# EAGLE design ESP32ProtypeBoard (EAGLE 9.6.2)
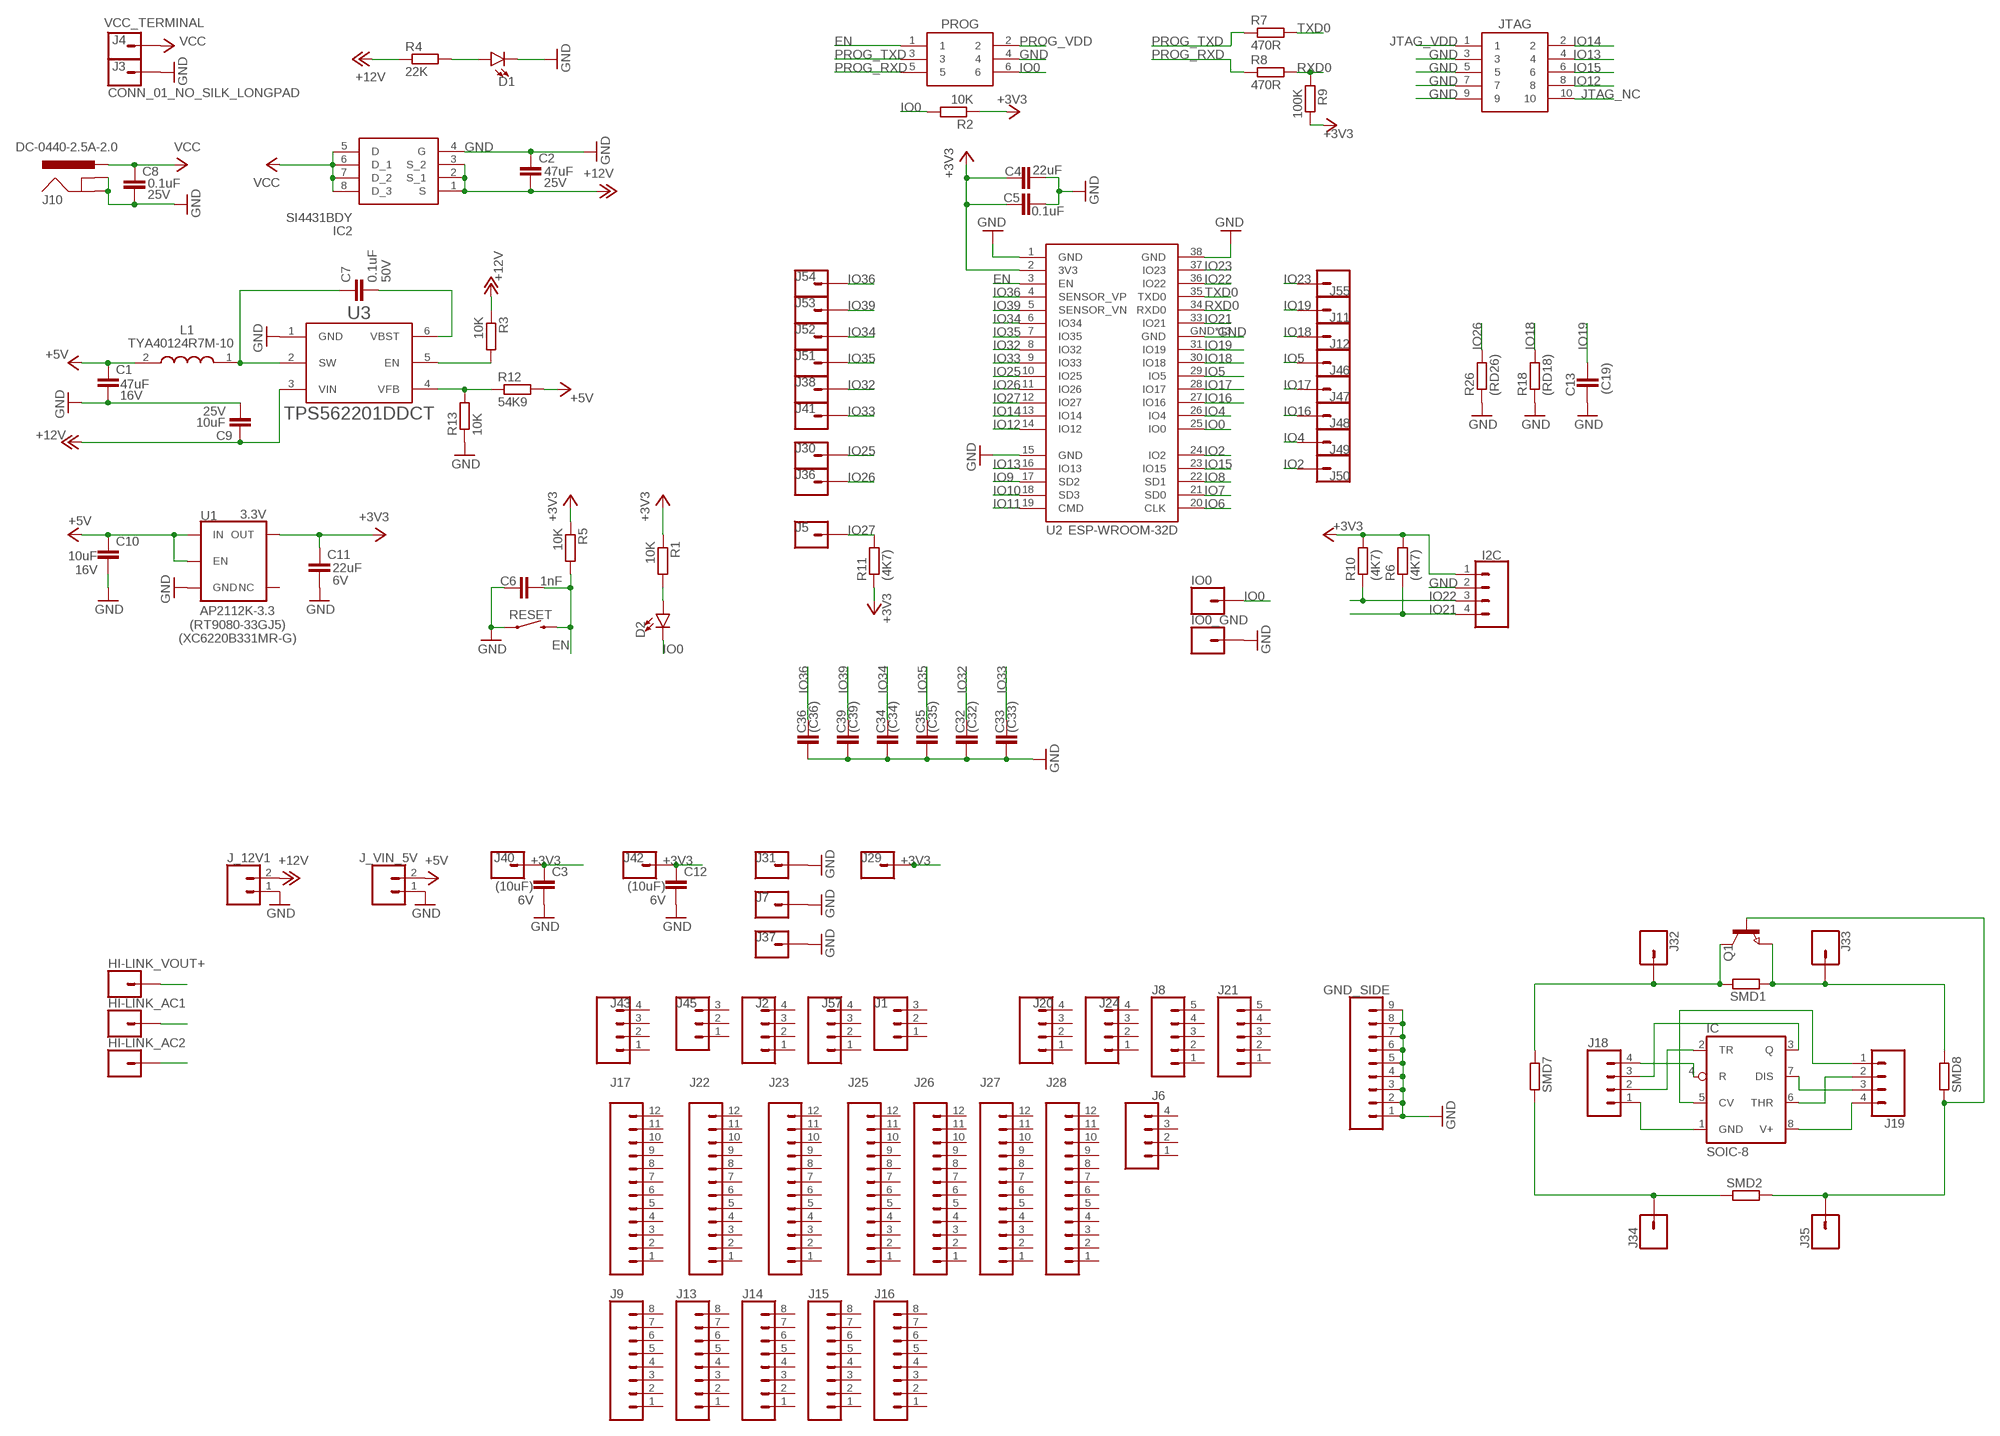
[diagram p0: schematic, sheet 1]

## Parts
C1  47uF  C-EUC1206K  [C1206K]
C2  47uF  C-EUC1206K  [C1206K]
C3  (10uF)  C-EUC0805K  [C0805K]
C4  22uF  C-EUC0805K  [C0805K]
C5  0.1uF  C-EUC0805K  [C0805K]
C6  1nF  C-EUC0805K  [C0805K]
C7  0.1uF  C-EUC0805K  [C0805K]
C8  0.1uF  C-EUC0805K  [C0805K]
C9  10uF  C-EUC0805K  [C0805K]
C10  10uF  C-EUC0805K  [C0805K]
C11  22uF  C-EUC0805K  [C0805K]
C12  (10uF)  C-EUC0805K  [C0805K]
C13  (C19)  C-EUC0805K  [C0805K]
C32  (C32)  C-EUC0805K  [C0805K]
C33  (C33)  C-EUC0805K  [C0805K]
C34  (C34)  C-EUC0805K  [C0805K]
C35  (C35)  C-EUC0805K  [C0805K]
C36  (C36)  C-EUC0805K  [C0805K]
C39  (C39)  C-EUC0805K  [C0805K]
D1  PWR  LEDCHIPLED_0805  [CHIPLED_0805]
D2  GREEN  LEDCHIPLED_0805  [CHIPLED_0805]
GND_SIDE  CONN_09NO_SILK  [1X09_NO_SILK]
HI-LINK_AC1  CONN_01PTH_NO_SILK_KIT  [1X01NS_KIT]
HI-LINK_AC2  CONN_01PTH_NO_SILK_KIT  [1X01NS_KIT]
HI-LINK_VOUT+  CONN_01PTH_NO_SILK_KIT  [1X01NS_KIT]
I2C  CONN_041X04_NO_SILK  [1X04_NO_SILK]
IC  SOIC-8  LM555D  [SO08]
IC2  SI4431BDY  SI4431BDY-T1-E3  [SOIC127P600X175-8N]
IO0  CONN_01PTH_NO_SILK_KIT  [1X01NS_KIT]
IO0_GND  CONN_01PTH_NO_SILK_YES_STOP  [1X01_NO_SILK]
J1  CONN_03_NO_SILK  [1X03_NO_SILK]
J2  CONN_04_NO_SILK  [1X04_NO_SILK]
J3  CONN_01_NO_SILK_LONGPAD  [1X01_NO_SILK_LONGPAD]
J4  VCC_TERMINAL  CONN_01_NO_SILK_LONGPAD  [1X01_NO_SILK_LONGPAD]
J5  CONN_01_NO_SILK  [1X01_NO_SILK]
J6  CONN_04_NO_SILK  [1X04_NO_SILK]
J7  CONN_01_NO_SILK  [1X01_NO_SILK]
J8  CONN_05_NO_SILK  [1X05_NO_SILK]
J9  CONN_08NO_SILK_FEMALE_PTH  [1X08_NO_SILK]
J10  DC-0440-2.5A-2.0  [DC044025A20]
J11  CONN_01PTH_NO_SILK_YES_STOP  [1X01_NO_SILK]
J12  CONN_01PTH_NO_SILK_YES_STOP  [1X01_NO_SILK]
J13  CONN_08NO_SILK_FEMALE_PTH  [1X08_NO_SILK]
J14  CONN_08NO_SILK_FEMALE_PTH  [1X08_NO_SILK]
J15  CONN_08NO_SILK_FEMALE_PTH  [1X08_NO_SILK]
J16  CONN_08NO_SILK_FEMALE_PTH  [1X08_NO_SILK]
J17  CONN_12NO_SILK  [1X12_NO_SILK]
J18  CONN_041X04_NO_SILK  [1X04_NO_SILK]
J19  CONN_041X04_NO_SILK  [1X04_NO_SILK]
J20  CONN_04_NO_SILK  [1X04_NO_SILK]
J21  CONN_05_NO_SILK  [1X05_NO_SILK]
J22  CONN_12NO_SILK  [1X12_NO_SILK]
J23  CONN_12NO_SILK  [1X12_NO_SILK]
J24  CONN_04_NO_SILK  [1X04_NO_SILK]
J25  CONN_12NO_SILK  [1X12_NO_SILK]
J26  CONN_12NO_SILK  [1X12_NO_SILK]
J27  CONN_12NO_SILK  [1X12_NO_SILK]
J28  CONN_12NO_SILK  [1X12_NO_SILK]
J29  CONN_01_NO_SILK  [1X01_NO_SILK]
J30  CONN_01_NO_SILK  [1X01_NO_SILK]
J31  CONN_01_NO_SILK  [1X01_NO_SILK]
J32  CONN_01PTH_NO_SILK_YES_STOP  [1X01_NO_SILK]
J33  CONN_01PTH_NO_SILK_YES_STOP  [1X01_NO_SILK]
J34  CONN_01PTH_NO_SILK_YES_STOP  [1X01_NO_SILK]
J35  CONN_01PTH_NO_SILK_YES_STOP  [1X01_NO_SILK]
J36  CONN_01_NO_SILK  [1X01_NO_SILK]
J37  CONN_01_NO_SILK  [1X01_NO_SILK]
J38  CONN_01_NO_SILK  [1X01_NO_SILK]
J40  CONN_01_NO_SILK  [1X01_NO_SILK]
J41  CONN_01_NO_SILK  [1X01_NO_SILK]
J42  CONN_01_NO_SILK  [1X01_NO_SILK]
J43  CONN_04_NO_SILK  [1X04_NO_SILK]
J45  CONN_03_NO_SILK  [1X03_NO_SILK]
J46  CONN_01PTH_NO_SILK_YES_STOP  [1X01_NO_SILK]
J47  CONN_01PTH_NO_SILK_YES_STOP  [1X01_NO_SILK]
J48  CONN_01PTH_NO_SILK_YES_STOP  [1X01_NO_SILK]
J49  CONN_01PTH_NO_SILK_YES_STOP  [1X01_NO_SILK]
J50  CONN_01PTH_NO_SILK_YES_STOP  [1X01_NO_SILK]
J51  CONN_01_NO_SILK  [1X01_NO_SILK]
J52  CONN_01_NO_SILK  [1X01_NO_SILK]
J53  CONN_01_NO_SILK  [1X01_NO_SILK]
J54  CONN_01_NO_SILK  [1X01_NO_SILK]
J55  CONN_01PTH_NO_SILK_YES_STOP  [1X01_NO_SILK]
J57  CONN_04_NO_SILK  [1X04_NO_SILK]
J_12V1  CONN_021X02_NO_SILK  [1X02_NO_SILK]
J_VIN_5V  CONN_021X02_NO_SILK  [1X02_NO_SILK]
JTAG  DC3-10-1P27  [DC3-10-1P27]
L1  TYA40124R7M-10  [INDPM4040X130N]
PROG  DC3-06-1P27  [DC3-06-1P27]
Q1  NPN-TRANSISTOR_SOT23  [SOT23]
R1  10K  R-EU_R0805  [R0805]
R2  10K  R-EU_R0805  [R0805]
R3  10K  R-EU_R0805  [R0805]
R4  22K  R-EU_R0805  [R0805]
R5  10K  R-EU_R0805  [R0805]
R6  (4K7)  R-EU_R0805  [R0805]
R7  470R  R-EU_R0805  [R0805]
R8  470R  R-EU_R0805  [R0805]
R9  100K  R-EU_R0805  [R0805]
R10  (4K7)  R-EU_R0805  [R0805]
R11  (4K7)  R-EU_R0805  [R0805]
R12  54K9  R-EU_R0805  [R0805]
R13  10K  R-EU_R0805  [R0805]
R18  (RD18)  R-EU_R0805  [R0805]
R26  (RD26)  R-EU_R0805  [R0805]
RESET  RESET  TACTILE_SWITCH_SMD_4X3MM  [TACTILE_SWITCH_SMD_4X3MM]
SMD1  RR1206  [R1206]
SMD2  RR1206  [R1206]
SMD7  RR1206  [R1206]
SMD8  RR1206  [R1206]
U1  3.3V  V_REG_AP2112K-3.3V  [SOT23-5]
U2  ESP-WROOM-32D  [ESP-WROOM-32D]
U3  TPS562201DDCTTEXAS_INSTRUMENTS_TPS562201DDCT_0_0  [TEXAS_INSTRUMENTS_TPS562201DDCT_0]

## Nets
+3V3: C3.1 C4.1 C5.1 C11.1 C12.1 I2C.1 J29.1 J40.1 J42.1 R1.1 R2.1 R5.1 R6.2 R9.1 R10.2 R11.1 U1.5(OUT) U2.2(3V3)
+5V: C1.1 C10.1 J_VIN_5V.2 L1.2 R12.2 U1.1(IN) U1.3(EN)
+12V: C2.2 C9.1 IC2.1(S) IC2.2(S_1) IC2.3(S_2) J_12V1.2 R3.1 R4.1 U3.3(VIN)
AC1: HI-LINK_AC1.1
AC2: HI-LINK_AC2.1
D2A: D2.A R1.2
EN: C6.2 PROG.1 R5.2 RESET.2 U2.3(EN)
GND: C1.2 C2.1 C3.2 C4.2 C5.2 C6.1 C8.2 C9.2 C10.2 C11.2 C12.2 C13.2 C32.1 C33.1 C34.1 C35.1 C36.1 C39.1 D1.C GND_SIDE.1 GND_SIDE.2 GND_SIDE.3 GND_SIDE.4 GND_SIDE.5 GND_SIDE.6 GND_SIDE.7 GND_SIDE.8 GND_SIDE.9 I2C.2 IC2.4(G) IO0_GND.1 J3.1 J7.1 J10.2(GND) J10.3(GNDBREAK) J31.1 J37.1 J_12V1.1 J_VIN_5V.1 JTAG.3 JTAG.5 JTAG.7 JTAG.9 PROG.4 R13.1 R18.1 R26.1 RESET.1 U1.2(GND) U2.1(GND) U2.15(GND) U2.38(GND) U2.GND U2.GND_1(GND) U2.GND_2(GND) U2.GND_3(GND) U2.GND_4(GND) U2.GND_5(GND) U2.GND_6(GND) U2.GND_7(GND) U2.GND_8(GND) U2.GND_9(GND) U2.GND_10(GND) U2.GND_11(GND) U2.GND_12(GND) U3.1(GND)
IO0: D2.C IO0.1 PROG.6 R2.2 U2.25(IO0)
IO2: J50.1 U2.24(IO2)
IO4: J49.1 U2.26(IO4)
IO5: J46.1 U2.29(IO5)
IO6 [NC]: U2.20(CLK)
IO7 [NC]: U2.21(SD0)
IO8 [NC]: U2.22(SD1)
IO9 [NC]: U2.17(SD2)
IO10 [NC]: U2.18(SD3)
IO11 [NC]: U2.19(CMD)
IO12: JTAG.8 U2.14(IO12)
IO13: JTAG.4 U2.16(IO13)
IO14: JTAG.2 U2.13(IO14)
IO15: JTAG.6 U2.23(IO15)
IO16: J48.1 U2.27(IO16)
IO17: J47.1 U2.28(IO17)
IO18: J12.1 R18.2 U2.30(IO18)
IO19: C13.1 J11.1 U2.31(IO19)
IO21: I2C.4 R6.1 U2.33(IO21)
IO22: I2C.3 R10.1 U2.36(IO22)
IO23: J55.1 U2.37(IO23)
IO25: J30.1 U2.10(IO25)
IO26: J36.1 R26.2 U2.11(IO26)
IO27: J5.1 R11.2 U2.12(IO27)
IO32: C32.2 J38.1 U2.8(IO32)
IO33: C33.2 J41.1 U2.9(IO33)
IO34: C34.2 J52.1 U2.6(IO34)
IO35: C35.2 J51.1 U2.7(IO35)
IO36: C36.2 J54.1 U2.4(SENSOR_VP)
IO39: C39.2 J53.1 U2.5(SENSOR_VN)
JTAG_NC: JTAG.10
JTAG_VDD: JTAG.1
N$3: IC.7(DIS) J19.3
N$4: IC.6(THR) J19.2
N$5: IC.1(GND) J18.1
N$6: IC.2(TR) J18.2
N$7: IC.3(Q) J18.3
N$8: IC.4(R) J18.4
N$9: IC.5(CV) J19.1
N$10: IC.8(V+) J19.4
N$13: HI-LINK_VOUT+.1
N$15: J34.1 SMD2.1 SMD7.2
N$16: J35.1 Q1.1(B) SMD2.2 SMD8.2
N$18: J32.1 Q1.3(C) SMD1.2 SMD7.1
N$19: J33.1 Q1.2(E) SMD1.1 SMD8.1
PROG_RXD: PROG.5 R8.1
PROG_TXD: PROG.3 R7.1
PROG_VDD: PROG.2
PWR_LED: D1.A R4.2
RXD0: R8.2 R9.2 U2.34(RXD0)
SW: C7.1 L1.1 U3.2(SW)
TXD0: R7.2 U2.35(TXD0)
VBST: C7.2 U3.6(VBST)
VCC: C8.1 IC2.5(D) IC2.6(D_1) IC2.7(D_2) IC2.8(D_3) J4.1 J10.1(PWR)
VEN: R3.2 U3.5(EN)
VFB: R12.1 R13.2 U3.4(VFB)
Unconnected: J1.1 J1.2 J1.3 J2.1 J2.2 J2.3 J2.4 J6.1 J6.2 J6.3 J6.4 J8.1 J8.2 J8.3 J8.4 J8.5 J9.1 J9.2 J9.3 J9.4 J9.5 J9.6 J9.7 J9.8 J13.1 J13.2 J13.3 J13.4 J13.5 J13.6 J13.7 J13.8 J14.1 J14.2 J14.3 J14.4 J14.5 J14.6 J14.7 J14.8 J15.1 J15.2 J15.3 J15.4 J15.5 J15.6 J15.7 J15.8 J16.1 J16.2 J16.3 J16.4 J16.5 J16.6 J16.7 J16.8 J17.1 J17.2 J17.3 J17.4 J17.5 J17.6 J17.7 J17.8 J17.9 J17.10 J17.11 J17.12 J20.1 J20.2 J20.3 J20.4 J21.1 J21.2 J21.3 J21.4 J21.5 J22.1 J22.2 J22.3 J22.4 J22.5 J22.6 J22.7 J22.8 J22.9 J22.10 J22.11 J22.12 J23.1 J23.2 J23.3 J23.4 J23.5 J23.6 J23.7 J23.8 J23.9 J23.10 J23.11 J23.12 J24.1 J24.2 J24.3 J24.4 J25.1 J25.2 J25.3 J25.4 J25.5 J25.6 J25.7 J25.8 J25.9 J25.10 J25.11 J25.12 J26.1 J26.2 J26.3 J26.4 J26.5 J26.6 J26.7 J26.8 J26.9 J26.10 J26.11 J26.12 J27.1 J27.2 J27.3 J27.4 J27.5 J27.6 J27.7 J27.8 J27.9 J27.10 J27.11 J27.12 J28.1 J28.2 J28.3 J28.4 J28.5 J28.6 J28.7 J28.8 J28.9 J28.10 J28.11 J28.12 J43.1 J43.2 J43.3 J43.4 J45.1 J45.2 J45.3 J57.1 J57.2 J57.3 J57.4 U1.4(NC)

## Notes on the sheet
- AP2112K-3.3
  (RT9080-33GJ5)
  (XC6220B331MR-G)

## Library data of the parts
C1 C10 = rcl:C-EU: CAPACITOR, European symbol; SPICEPREFIX: C; VOLTAGE: 16V
C2 C8 C9 = rcl:C-EU: CAPACITOR, European symbol; SPICEPREFIX: C; VOLTAGE: 25V
C3 C11 C12 = rcl:C-EU: CAPACITOR, European symbol; SPICEPREFIX: C; VOLTAGE: 6V
C4-C6 C13 C32-C36 C39 = rcl:C-EU: CAPACITOR, European symbol; SPICEPREFIX: C
C7 = rcl:C-EU: CAPACITOR, European symbol; SPICEPREFIX: C; VOLTAGE: 50V
D1 D2 = led:LED: LED OSRAM: - CHIPLED LG R971, LG N971, LY N971, LG Q971, LY Q971, LO R971, LY R971 LH N974, LH R974 LS Q976, LO Q976, LY Q976 LO Q996 - Hyper CHIPLED LW Q18S LB Q993, LB Q99A, LB R99A - SideLED LS A670, LO A670, LY A670, LG A670, LP A670 LB A673, LV A673, LT A673, LW A673 LH A674 LY A675 LS A676, LA A676, LO A676, LY A676, LW A676 LS A679, LY A679, LG A679 - Hyper Micro SIDELED® LS Y876, LA Y876, LO Y876, LY Y876 LT Y87S - SmartLED LW L88C, LW L88S LB L89C, LB L89S, LG L890 LS L89K, LO L89K, LY L89K LS L896, LA L896, LO L896, LY L896 - TOPLED LS T670, LO T670, LY T670, LG T670, LP T670 LSG T670, LSP T670, LSY T670, LOP T670, LYG T670 LG T671, LOG T671, LSG T671 LB T673, LV T673, LT T673, LW T673 LH T674 LS T676, LA T676, LO T676, LY T676, LB T676, LH T676, LSB T676, LW T676 LB T67C, LV T67C, LT T67C, LS T67K, LO T67K, LY T67K, LW E67C LS E67B, LA E67B, LO E67B, LY E67B, LB E67C, LV E67C, LT E67C LW T67C LS T679, LY T679, LG T679 LS T770, LO T770, LY T770, LG T770, LP T770 LB T773, LV T773, LT T773, LW T773 LH T774 LS E675, LA E675, LY E675, LS T675 LS T776, LA T776, LO T776, LY T776, LB T776 LHGB T686 LT T68C, LB T68C - Hyper Mini TOPLED® LB M676 - Mini TOPLED Santana® LG M470 LS M47K, LO M47K, LY M47K Source: http://www.osram.convergy.de LUXEON: - LUMILED® LXK2-PW12-R00, LXK2-PW12-S00, LXK2-PW14-U00, LXK2-PW14-V00 LXK2-PM12-R00, LXK2-PM12-S00, LXK2-PM14-U00 LXK2-PE12-Q00, LXK2-PE12-R00, LXK2-PE12-S00, LXK2-PE14-T00, LXK2-PE14-U00 LXK2-PB12-K00, LXK2-PB12-L00, LXK2-PB12-M00, LXK2-PB14-N00, LXK2-PB14-P00, LXK2-PB14-Q00 LXK2-PR12-L00, LXK2-PR12-M00, LXK2-PR14-Q00, LXK2-PR14-R00 LXK2-PD12-Q00, LXK2-PD12-R00, LXK2-PD12-S00 LXK2-PH12-R00, LXK2-PH12-S00 LXK2-PL12-P00, LXK2-PL12-Q00, LXK2-PL12-R00 Source: www.luxeon.com KINGBRIGHT: KA-3528ASYC Source: www.kingbright.com
GND_SIDE = SparkFun-Connectors:CONN_09: Multi connection point. Often used as Generic Header-pin footprint for 0.1 inch spaced/style header connections On any of the 0.1 inch spaced packages, you can populate with these: Break Away Headers - Straight <https://www.sparkfun.com/products/116> (PRT-00116) Break Away Male Headers - Right Angle <https://www.sparkfun.com/products/553> (PRT-00553) Female Headers <https://www.sparkfun.com/products/115> (PRT-00115) Break Away Headers - Machine Pin <https://www.sparkfun.com/products/117> (PRT-00117) Break Away Female Headers - Swiss Machine Pin <https://www.sparkfun.com/products/743> (PRT-00743) For SCREWTERMINALS and SPRING TERMINALS visit here: Screw Terimnals on SparkFun.com <https://www.sparkfun.com/search/results?term=Screw+Terminals> (5mm/3.5mm/2.54mm spacing) This device is also useful as a general connection point to wire up your design to another part of your project. Our various solder wires solder well into these plated through hole pads. Hook-Up Wire - Assortment (Stranded, 22 AWG) <https://www.sparkfun.com/products/11375> (PRT-11375) Hook-Up Wire - Assortment (Solid Core, 22 AWG) <https://www.sparkfun.com/products/11367> (PRT-11367) View the entire wire category on our website here <https://www.sparkfun.com/categories/141> Special notes: Molex polarized connector foot print use with SKU : PRT-08231 with associated crimp pins and housings. 1MM SMD Version SKU: PRT-10208 NOTES ON THE VARIANTS LOCK and LOCK_LONGPADS... This footprint was designed to help hold the alignment of a through-hole component (i.e. 6-pin header) while soldering it into place. You may notice that each hole has been shifted either up or down by 0.005 of an inch from it's more standard position (which is a perfectly straight line). This slight alteration caused the pins (the squares in the middle) to touch the edges of the holes. Because they are alternating, it causes a "brace" to hold the component in place. 0.005 has proven to be the perfect amount of "off-center" position when using our standard breakaway headers. Although looks a little odd when you look at the bare footprint, once you have a header in there, the alteration is very hard to notice. Also,if you push a header all the way into place, it is covered up entirely on the bottom side.
HI-LINK_AC1 HI-LINK_AC2 HI-LINK_VOUT+ IO0 IO0_GND J11 J12 J32-J35 J46-J50 J55 = SparkFun-Connectors:CONN_01: Single connection point. Often used as Generic Header-pin footprint for 0.1 inch spaced/style header connections On any of the 0.1 inch spaced packages, you can populate with these: Break Away Headers - Straight <https://www.sparkfun.com/products/116> (PRT-00116) Break Away Male Headers - Right Angle <https://www.sparkfun.com/products/553> (PRT-00553) Female Headers <https://www.sparkfun.com/products/115> (PRT-00115) Break Away Headers - Machine Pin <https://www.sparkfun.com/products/117> (PRT-00117) Break Away Female Headers - Swiss Machine Pin <https://www.sparkfun.com/products/743> (PRT-00743) This device is also useful as a general connection point to wire up your design to another part of your project. Our various solder wires solder well into these plated through hole pads. Hook-Up Wire - Assortment (Stranded, 22 AWG) <https://www.sparkfun.com/products/11375> (PRT-11375) Hook-Up Wire - Assortment (Solid Core, 22 AWG) <https://www.sparkfun.com/products/11367> (PRT-11367) View the entire wire category on our website here <https://www.sparkfun.com/categories/141> Special notes: SMTSO-256-ET is a "flush mount" nut for a 4-40 screw. We mostly use this on specialty testbeds; it is a nice way to connect hardware to your PCB at an adjustable hieght. Also note, the SNAP packages are for using a snappable style connector. We sell a baggie of snaps and they are also used on two LilyPad designs: Snap Assortment - 30 pack (male and female) <https://www.sparkfun.com/products/11347> (DEV-11347) LilyPad Arduino SimpleSnap <https://www.sparkfun.com/products/10941> (DEV-10941) LilyPad SimpleSnap Protoboard <https://www.sparkfun.com/products/10940> (DEV-10940)
I2C J18 J19 = SparkFun-Connectors:CONN_04: Multi connection point. Often used as Generic Header-pin footprint for 0.1 inch spaced/style header connections On any of the 0.1 inch spaced packages, you can populate with these: Break Away Headers - Straight <https://www.sparkfun.com/products/116> (PRT-00116) Break Away Male Headers - Right Angle <https://www.sparkfun.com/products/553> (PRT-00553) Female Headers <https://www.sparkfun.com/products/115> (PRT-00115) Break Away Headers - Machine Pin <https://www.sparkfun.com/products/117> (PRT-00117) Break Away Female Headers - Swiss Machine Pin <https://www.sparkfun.com/products/743> (PRT-00743) For SCREWTERMINALS and SPRING TERMINALS visit here: Screw Terimnals on SparkFun.com <https://www.sparkfun.com/search/results?term=Screw+Terminals> (5mm/3.5mm/2.54mm spacing) This device is also useful as a general connection point to wire up your design to another part of your project. Our various solder wires solder well into these plated through hole pads. Hook-Up Wire - Assortment (Stranded, 22 AWG) <https://www.sparkfun.com/products/11375> (PRT-11375) Hook-Up Wire - Assortment (Solid Core, 22 AWG) <https://www.sparkfun.com/products/11367> (PRT-11367) View the entire wire category on our website here <https://www.sparkfun.com/categories/141> Special notes: Molex polarized connector foot print use with SKU : PRT-08231 with associated crimp pins and housings. 1MM SMD Version SKU: PRT-10208; PROD_ID: CONN-09696
IC = linear:*555: TIMER
IC2 = SI4431BDY-T1-E3:SI4431BDY-T1-E3: SI4431BDY-T1-E3, P-channel MOSFET Transistor 5.7A 30V, 8-Pin SOIC Source: Datasheet <http://docs-asia.electrocomponents.com/webdocs/0ed1/0900766b80ed1eb7.pdf>; ALLIED_NUMBER: 70026219; ALLIED_PRICE-STOCK: http://www.alliedelec.com/siliconix-vishay-si4431bdy-t1-e3/70026219/; ARROW_PART_NUMBER: SI4431BDY-T1-E3; ARROW_PRICE-STOCK: https://www.arrow.com/en/products/si4431bdy-t1-e3/vishay; DESCRIPTION: SI4431BDY-T1-E3, P-channel MOSFET Transistor 5.7A 30V, 8-Pin SOIC; HEIGHT: 1.75mm; MANUFACTURER_NAME: Vishay; MANUFACTURER_PART_NUMBER: SI4431BDY-T1-E3; RS_PART_NUMBER: 7104714P; RS_PRICE-STOCK: http://uk.rs-online.com/web/p/products/7104714P
J1 J45 = my-connectors:CONN_03_NO_SILK
J2 J6 J20 J24 J43 J57 = my-connectors:CONN_04_NO_SILK
J3-J5 J7 J29-J31 J36-J38 J40-J42 J51-J54 = my-connectors:CONN_01_NO_SILK
J8 J21 = my-connectors:CONN_05_NO_SILK
J9 J13-J16 = SparkFun-Connectors:CONN_08: Multi connection point. Often used as Generic Header-pin footprint for 0.1 inch spaced/style header connections On any of the 0.1 inch spaced packages, you can populate with these: Break Away Headers - Straight <https://www.sparkfun.com/products/116> (PRT-00116) Break Away Male Headers - Right Angle <https://www.sparkfun.com/products/553> (PRT-00553) Female Headers <https://www.sparkfun.com/products/115> (PRT-00115) Break Away Headers - Machine Pin <https://www.sparkfun.com/products/117> (PRT-00117) Break Away Female Headers - Swiss Machine Pin <https://www.sparkfun.com/products/743> (PRT-00743) Arduino Stackable Header - 8 Pin <https://www.sparkfun.com/products/9279> (PRT-09279) For SCREWTERMINALS and SPRING TERMINALS visit here: Screw Terimnals on SparkFun.com <https://www.sparkfun.com/search/results?term=Screw+Terminals> (5mm/3.5mm/2.54mm spacing) This device is also useful as a general connection point to wire up your design to another part of your project. Our various solder wires solder well into these plated through hole pads. Hook-Up Wire - Assortment (Stranded, 22 AWG) <https://www.sparkfun.com/products/11375> (PRT-11375) Hook-Up Wire - Assortment (Solid Core, 22 AWG) <https://www.sparkfun.com/products/11367> (PRT-11367) View the entire wire category on our website here <https://www.sparkfun.com/categories/141> Special notes: Molex polarized connector foot print use with SKU : PRT-08231 with associated crimp pins and housings. 1MM SMD Version SKU: PRT-10208 NOTES ON THE VARIANTS LOCK and LOCK_LONGPADS... This footprint was designed to help hold the alignment of a through-hole component (i.e. 6-pin header) while soldering it into place. You may notice that each hole has been shifted either up or down by 0.005 of an inch from it's more standard position (which is a perfectly straight line). This slight alteration caused the pins (the squares in the middle) to touch the edges of the holes. Because they are alternating, it causes a "brace" to hold the component in place. 0.005 has proven to be the perfect amount of "off-center" position when using our standard breakaway headers. Although looks a little odd when you look at the bare footprint, once you have a header in there, the alteration is very hard to notice. Also,if you push a header all the way into place, it is covered up entirely on the bottom side.; PROD_ID: CONN-08438
J10 = DC-0440-2.5A-2.0:DC-0440-2.5A-2.0: DC Power Receptacle Jack 2.5A 2.0mm 6.0mm Through Hole AC/DC Power Plugs & Receptacles RoHS Source: Datasheet <https://datasheet.lcsc.com/szlcsc/1903151807_XKB-Enterprise-DC-0440-2-5A-2-0_C381118.pdf>; DESCRIPTION: DC Power Receptacle Jack 2.5A 2.0mm 6.0mm Through Hole AC/DC Power Plugs & Receptacles RoHS; HEIGHT: 7.3mm; MANUFACTURER_NAME: XKB Enterprise; MANUFACTURER_PART_NUMBER: DC-0440-2.5A-2.0
J17 J22 J23 J25-J28 = SparkFun-Connectors:CONN_12: Multi connection point. Often used as Generic Header-pin footprint for 0.1 inch spaced/style header connections On any of the 0.1 inch spaced packages, you can populate with these: Break Away Headers - Straight <https://www.sparkfun.com/products/116> (PRT-00116) Break Away Male Headers - Right Angle <https://www.sparkfun.com/products/553> (PRT-00553) Female Headers <https://www.sparkfun.com/products/115> (PRT-00115) Break Away Headers - Machine Pin <https://www.sparkfun.com/products/117> (PRT-00117) Break Away Female Headers - Swiss Machine Pin <https://www.sparkfun.com/products/743> (PRT-00743) For SCREWTERMINALS and SPRING TERMINALS visit here: Screw Terimnals on SparkFun.com <https://www.sparkfun.com/search/results?term=Screw+Terminals> (5mm/3.5mm/2.54mm spacing) This device is also useful as a general connection point to wire up your design to another part of your project. Our various solder wires solder well into these plated through hole pads. Hook-Up Wire - Assortment (Stranded, 22 AWG) <https://www.sparkfun.com/products/11375> (PRT-11375) Hook-Up Wire - Assortment (Solid Core, 22 AWG) <https://www.sparkfun.com/products/11367> (PRT-11367) View the entire wire category on our website here <https://www.sparkfun.com/categories/141> Special notes: Molex polarized connector foot print use with SKU : PRT-08231 with associated crimp pins and housings. 1MM SMD Version SKU: PRT-10208 NOTES ON THE VARIANTS LOCK and LOCK_LONGPADS... This footprint was designed to help hold the alignment of a through-hole component (i.e. 6-pin header) while soldering it into place. You may notice that each hole has been shifted either up or down by 0.005 of an inch from it's more standard position (which is a perfectly straight line). This slight alteration caused the pins (the squares in the middle) to touch the edges of the holes. Because they are alternating, it causes a "brace" to hold the component in place. 0.005 has proven to be the perfect amount of "off-center" position when using our standard breakaway headers. Although looks a little odd when you look at the bare footprint, once you have a header in there, the alteration is very hard to notice. Also,if you push a header all the way into place, it is covered up entirely on the bottom side.
J_12V1 J_VIN_5V = SparkFun-Connectors:CONN_02: Multi connection point. Often used as Generic Header-pin footprint for 0.1 inch spaced/style header connections On any of the 0.1 inch spaced packages, you can populate with these: Break Away Headers - Straight <https://www.sparkfun.com/products/116> (PRT-00116) Break Away Male Headers - Right Angle <https://www.sparkfun.com/products/553> (PRT-00553) Female Headers <https://www.sparkfun.com/products/115> (PRT-00115) Break Away Headers - Machine Pin <https://www.sparkfun.com/products/117> (PRT-00117) Break Away Female Headers - Swiss Machine Pin <https://www.sparkfun.com/products/743> (PRT-00743) For SCREWTERMINALS and SPRING TERMINALS visit here: Screw Terimnals on SparkFun.com <https://www.sparkfun.com/search/results?term=Screw+Terminals> (5mm/3.5mm/2.54mm spacing) This device is also useful as a general connection point to wire up your design to another part of your project. Our various solder wires solder well into these plated through hole pads. Hook-Up Wire - Assortment (Stranded, 22 AWG) <https://www.sparkfun.com/products/11375> (PRT-11375) Hook-Up Wire - Assortment (Solid Core, 22 AWG) <https://www.sparkfun.com/products/11367> (PRT-11367) View the entire wire category on our website here <https://www.sparkfun.com/categories/141> Special notes: Molex polarized connector foot print use with: PRT-08233 with associated crimp pins and housings. 2.54_SCREWTERM for use with PRT-10571. 3.5mm Screw Terminal footprints for PRT-08084 5mm Screw Terminal footprints for use with PRT-08432
JTAG = DC3-XX-1P27:DC3-10-1P27: Conn Shrouded Header (4 Sides) HDR 10 POS 1.27mm Solder ST Thru-Hole Source: Datasheet <https://datasheet.datasheetarchive.com/originals/dk/DKDS-7/133059.pdf>; ARROW_PART_NUMBER: 3220-10-0100-00; ARROW_PRICE-STOCK: https://www.arrow.com/en/products/3220-10-0100-00/cnc-tech-llc; DESCRIPTION: Conn Shrouded Header (4 Sides) HDR 10 POS 1.27mm Solder ST Thru-Hole; HEIGHT: 5.6mm; MANUFACTURER_NAME: CNC Tech; MANUFACTURER_PART_NUMBER: 3220-10-0100-00
L1 = TYA40124R7M-10:TYA40124R7M-10: Fixed Inductors 4.7uH 2.3A 20% Wire Wound Source: Datasheet; DESCRIPTION: Fixed Inductors 4.7uH 2.3A 20% Wire Wound; HEIGHT: 1.3mm; MANUFACTURER_NAME: Laird Performance Materials; MANUFACTURER_PART_NUMBER: TYA40124R7M-10
PROG = DC3-XX-1P27:DC3-06-1P27: Conn Shrouded Header (4 Sides) HDR 6 POS 1.27mm Solder ST Thru-Hole
Q1 = semicon-smd-ipc:NPN-TRANSISTOR_: NPN TRANSISTOR
R1-R13 R18 R26 = rcl:R-EU_: RESISTOR, European symbol; SPICEPREFIX: R
RESET = 4x3mm-tactile-switch:TACTILE_SWITCH_SMD_4X3MM: Momentary Switch (Pushbutton) - SPST - SMD, 4 x 3 mm Normally-open (NO) SPST momentary switches (buttons, pushbuttons). AliExpress Item <http://aliexpress.com/item/32698846968.html>
SMD1 SMD2 SMD7 SMD8 = eagle-ltspice:R: RESISTOR, European symbol; SPICEMODEL: NONE; SPICEPREFIX: R
U1 = SparkFun-IC-Power:V_REG_AP2112: AP2112 - 600mA CMOS LDO Regulator w/ Enable The AP2112 is CMOS process low dropout linear regulator with enable function, the regulator delivers a guaranteed 600mA (min.) continuous load current. Features Output Voltage Accuracy: ±1.5% Output Current: 600mA (Min.) Foldback Short Current Protection: 50mA Enable Function to Turn ON/OFF VOUT Low Dropout Voltage (3.3V): 250mV (Typ.) @IOUT=600mA Excellent Load Regulation: 0.2%/A (Typ.) Excellent Line Regulation: 0.02%/V (Typ.) Low Quiescent Current: 55μA (Typ.) Low Standby Current: 0.01μA (Typ.) Low Output Noise: 50μVRMS PSRR: 100Hz -65dB, 1kHz -65dB OTSD Protection Stable with 1.0μF Flexible Cap: Ceramic, Tantalum and Aluminum Electrolytic Operation Temperature Range: -40°C to 85°C ESD: MM 400V, HBM 4000V; PROD_ID: VREG-12457
U2 = esp32-modified:ESP-WROOM-32D: Espressif Systems ESP-WROOM-32
U3 = TPS562201DDCT:TPS562201DDCT: Buck Switching Regulator IC Positive Adjustable 0.768V 1 Output 2A SOT-23-6 Thin, TSOT-23-6; AUTOMOTIVE: No; CENTROID_NOT_SPECIFIED: No; DATASHEET: http://www.ti.com/lit/ds/symlink/tps562201.pdf; DEVICE_CLASS_L1: Integrated Circuits (ICs); DEVICE_CLASS_L2: Power Management ICs; DEVICE_CLASS_L3: Voltage Regulators - Switching; DIGIKEY_DESCRIPTION: IC REG BUCK ADJ 2A TSOT23-6; DIGIKEY_PART_NUMBER: 296-43699-1-ND; FOOTPRINT_PARAMETERS_0: {"fp_type":"SOT23","params":{"N":{"default":"6","long name":"Number of leads","type":"multichoice","short name":"N"},"A":{"nom":false,"long name":"Height","min":false,"max":1100000,"short name":"A","type":"measurement"},"A1":{"nom":false,"long name":"Package clearance","min":0,"max":100000,"short name":"A1","type":"measurement"},"A2":{"nom":false,"long name":"Package height","min":false,"max":1000000,"short name":"A2","type":"measurement"},"D":{"nom":false,"long name":"Package length","min":2750000,"max":3050000,"short name":"D","type":"measurement"},"E":{"nom":false,"long name":"Width /w leads","min":2550000,"max":3050000,"short name":"E","type":"measurement"},"E1":{"nom":false,"long name":"Package width","min":1450000,"max":1750000,"short name":"E1","type":"measurement"},"B":{"nom":false,"long name":"Lead width","min":300000,"max":500000,"short name":"B","type":"measurement"},"C":{"nom":false,"long name":"Lead thickness","min":120000,"max":200000,"short name":"C","type":"measurement"},"L":{"nom":false,"long name":"Lead foot length","min":300000,"max":600000,"short name":"L","type":"measurement"},"e":{"nom":950000,"long name":"Lead pitch","min":null,"max":null,"short name":"e","type":"measurement"},"PHI":{"nom":false,"long name":"Lead angle","min":0,"max":8,"short name":"PHI","type":"measurement"},"offset x":{"nom":0,"long name":"X Center offset","min":null,"max":null,"short name":"offset x","type":"measurement"},"offset y":{"nom":0,"long name":"Y Center offset","min":null,"max":null,"short name":"offset y","type":"measurement"},"LS":{"default":"Rounded rectangle","long name":"Land shape","type":"multichoice","short name":"LS"},"LS1":{"default":"Rectangle","long name":"Land shape (Pin 1)","type":"multichoice","short name":"LS1"},"solder toe":{"nom":550000,"long name":"Solder fillet (toe)","min":null,"max":null,"short name":"solder toe","type":"fixedmeasurement"},"solder heel":{"nom":450000,"long name":"Solder fillet (heel)","min":null,"max":null,"short name":"solder heel","type":"fixedmeasurement"},"solder side":{"nom":50000,"long name":"Solder fillet (side)","min":null,"max":null,"short name":"solder side","type":"fixedmeasurement"},"courtyard":{"nom":500000,"long name":"Courtyard","min":null,"max":null,"short name":"courtyard","type":"fixedmeasurement"},"SF":{"default":"A","long name":"Packing level","type":"multichoiceparent","short name":"SF","help":"http://support.upverter.com/customer/portal/articles/978783-what-is-a-footprint-packing-level","children":["solder toe","solder heel","solder side","courtyard"]}}}; FOOTPRINT_PARAMETERS_2: {"fp_type":"SOT23","params":{"N":{"default":"6","long name":"Number of leads","type":"multichoice","short name":"N"},"A":{"nom":false,"long name":"Height","min":false,"max":1100000,"short name":"A","type":"measurement"},"A1":{"nom":false,"long name":"Package clearance","min":0,"max":100000,"short name":"A1","type":"measurement"},"A2":{"nom":false,"long name":"Package height","min":false,"max":1000000,"short name":"A2","type":"measurement"},"D":{"nom":false,"long name":"Package length","min":2750000,"max":3050000,"short name":"D","type":"measurement"},"E":{"nom":false,"long name":"Width /w leads","min":2550000,"max":3050000,"short name":"E","type":"measurement"},"E1":{"nom":false,"long name":"Package width","min":1450000,"max":1750000,"short name":"E1","type":"measurement"},"B":{"nom":false,"long name":"Lead width","min":300000,"max":500000,"short name":"B","type":"measurement"},"C":{"nom":false,"long name":"Lead thickness","min":120000,"max":200000,"short name":"C","type":"measurement"},"L":{"nom":false,"long name":"Lead foot length","min":300000,"max":600000,"short name":"L","type":"measurement"},"e":{"nom":950000,"long name":"Lead pitch","min":null,"max":null,"short name":"e","type":"measurement"},"PHI":{"nom":false,"long name":"Lead angle","min":0,"max":8,"short name":"PHI","type":"measurement"},"offset x":{"nom":0,"long name":"X Center offset","min":null,"max":null,"short name":"offset x","type":"measurement"},"offset y":{"nom":0,"long name":"Y Center offset","min":null,"max":null,"short name":"offset y","type":"measurement"},"LS":{"default":"Rounded rectangle","long name":"Land shape","type":"multichoice","short name":"LS"},"LS1":{"default":"Rectangle","long name":"Land shape (Pin 1)","type":"multichoice","short name":"LS1"},"solder toe":{"nom":350000,"long name":"Solder fillet (toe)","min":null,"max":null,"short name":"solder toe","type":"fixedmeasurement"},"solder heel":{"nom":350000,"long name":"Solder fillet (heel)","min":null,"max":null,"short name":"solder heel","type":"fixedmeasurement"},"solder side":{"nom":30000,"long name":"Solder fillet (side)","min":null,"max":null,"short name":"solder side","type":"fixedmeasurement"},"courtyard":{"nom":250000,"long name":"Courtyard","min":null,"max":null,"short name":"courtyard","type":"fixedmeasurement"},"SF":{"default":"B","long name":"Packing level","type":"multichoiceparent","short name":"SF","help":"http://support.upverter.com/customer/portal/articles/978783-what-is-a-footprint-packing-level","children":["solder toe","solder heel","solder side","courtyard"]}}}; FOOTPRINT_PARAMETERS_3: {"fp_type":"SOT23","params":{"N":{"default":"6","long name":"Number of leads","type":"multichoice","short name":"N"},"A":{"nom":false,"long name":"Height","min":false,"max":1100000,"short name":"A","type":"measurement"},"A1":{"nom":false,"long name":"Package clearance","min":0,"max":100000,"short name":"A1","type":"measurement"},"A2":{"nom":false,"long name":"Package height","min":false,"max":1000000,"short name":"A2","type":"measurement"},"D":{"nom":false,"long name":"Package length","min":2750000,"max":3050000,"short name":"D","type":"measurement"},"E":{"nom":false,"long name":"Width /w leads","min":2550000,"max":3050000,"short name":"E","type":"measurement"},"E1":{"nom":false,"long name":"Package width","min":1450000,"max":1750000,"short name":"E1","type":"measurement"},"B":{"nom":false,"long name":"Lead width","min":300000,"max":500000,"short name":"B","type":"measurement"},"C":{"nom":false,"long name":"Lead thickness","min":120000,"max":200000,"short name":"C","type":"measurement"},"L":{"nom":false,"long name":"Lead foot length","min":300000,"max":600000,"short name":"L","type":"measurement"},"e":{"nom":950000,"long name":"Lead pitch","min":null,"max":null,"short name":"e","type":"measurement"},"PHI":{"nom":false,"long name":"Lead angle","min":0,"max":8,"short name":"PHI","type":"measurement"},"offset x":{"nom":0,"long name":"X Center offset","min":null,"max":null,"short name":"offset x","type":"measurement"},"offset y":{"nom":0,"long name":"Y Center offset","min":null,"max":null,"short name":"offset y","type":"measurement"},"LS":{"default":"Rounded rectangle","long name":"Land shape","type":"multichoice","short name":"LS"},"LS1":{"default":"Rectangle","long name":"Land shape (Pin 1)","type":"multichoice","short name":"LS1"},"solder toe":{"nom":150000,"long name":"Solder fillet (toe)","min":null,"max":null,"short name":"solder toe","type":"fixedmeasurement"},"solder heel":{"nom":250000,"long name":"Solder fillet (heel)","min":null,"max":null,"short name":"solder heel","type":"fixedmeasurement"},"solder side":{"nom":10000,"long name":"Solder fillet (side)","min":null,"max":null,"short name":"solder side","type":"fixedmeasurement"},"courtyard":{"nom":100000,"long name":"Courtyard","min":null,"max":null,"short name":"courtyard","type":"fixedmeasurement"},"SF":{"default":"C","long name":"Packing level","type":"multichoiceparent","short name":"SF","help":"http://support.upverter.com/customer/portal/articles/978783-what-is-a-footprint-packing-level","children":["solder toe","solder heel","solder side","courtyard"]}}}; FOOTPRINT_VARIANT_NAME_0: Recommended_Land_Pattern; FOOTPRINT_VARIANT_NAME_1: IPC_A; FOOTPRINT_VARIANT_NAME_2: IPC_B; FOOTPRINT_VARIANT_NAME_3: IPC_C; HEIGHT: 1.1mm; LEAD_FREE: Yes; MAX_DUTY_CYCLE: 80%; MAX_JUNCTION_TEMP: +125°C; MAX_SUPPLY_VOLTAGE: 17V; MF: Texas Instruments; MFG_PACKAGE_IDENT: DDC0006A; MFG_PACKAGE_IDENT_COMPONENT_ID: d979acf83414fc4e; MFG_PACKAGE_IDENT_DATE: 0; MFG_PACKAGE_IDENT_REV: 0; MIN_SUPPLY_VOLTAGE: 4.5V; MOUSER_DESCRIPTION: Conv DC-DC 4.5V to 17V Synchronous Step Down Single-Out 0.76V to 7V 2A 6-Pin TSOT-23 T/R; MOUSER_PART_NUMBER: 595-TPS562201DDCT; MPN: TPS562201DDCT; NOMINAL_SUPPLY_CURRENT: 380uA; NUMBER_OF_OUTPUTS: 1; OUTPUT_CURRENT: 2A; OUTPUT_TYPE: AdjustableProgrammable; OUTPUT_VOLTAGE: 0.76-7V; PACKAGE: TSOT23-6; PREFIX: U; ROHS: Yes; STANDOFF_HEIGHT: 0mm; SWITCHING_FREQUENCY: 580kHz; SWITCHING_TOPOLOGY: Buck; TEMPERATURE_RANGE_HIGH: +125°C; TEMPERATURE_RANGE_LOW: -40°C; VERIFICATION_VERSION: 0.0.0.3

## Net classes
0 default: clearance 0.205 mm

## Board
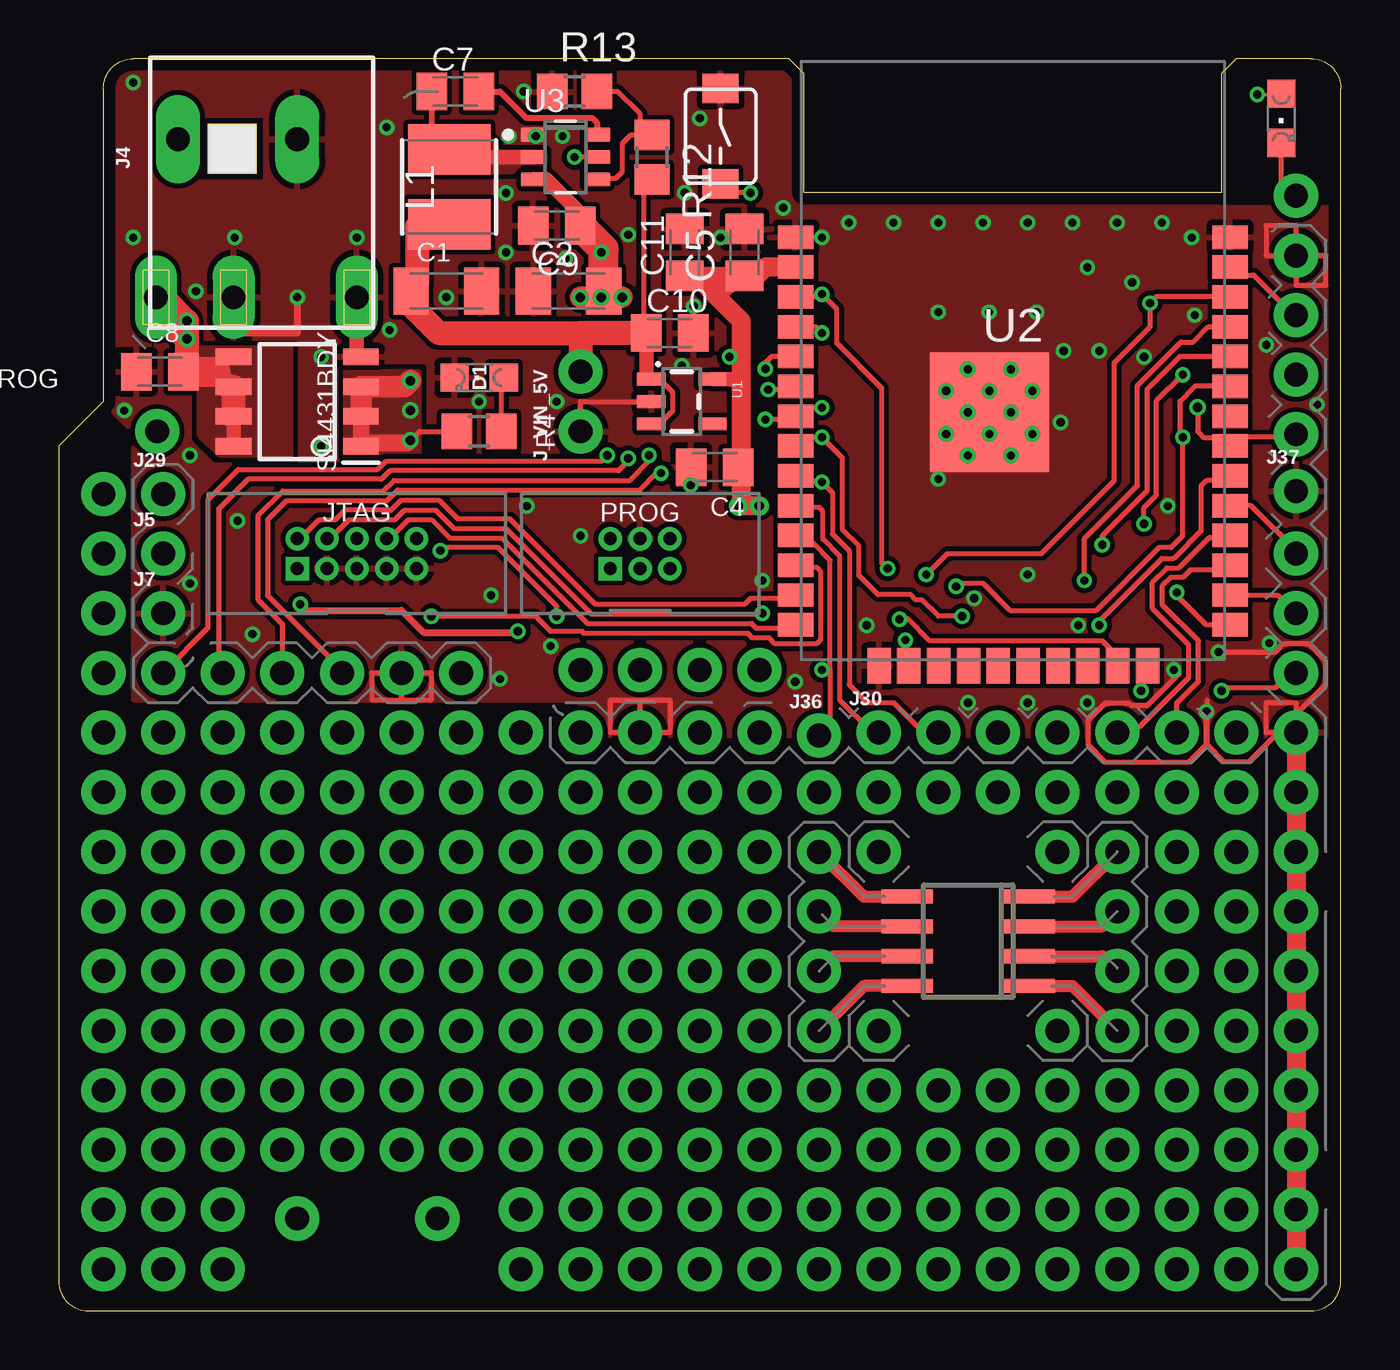
[diagram p1: board, top side]
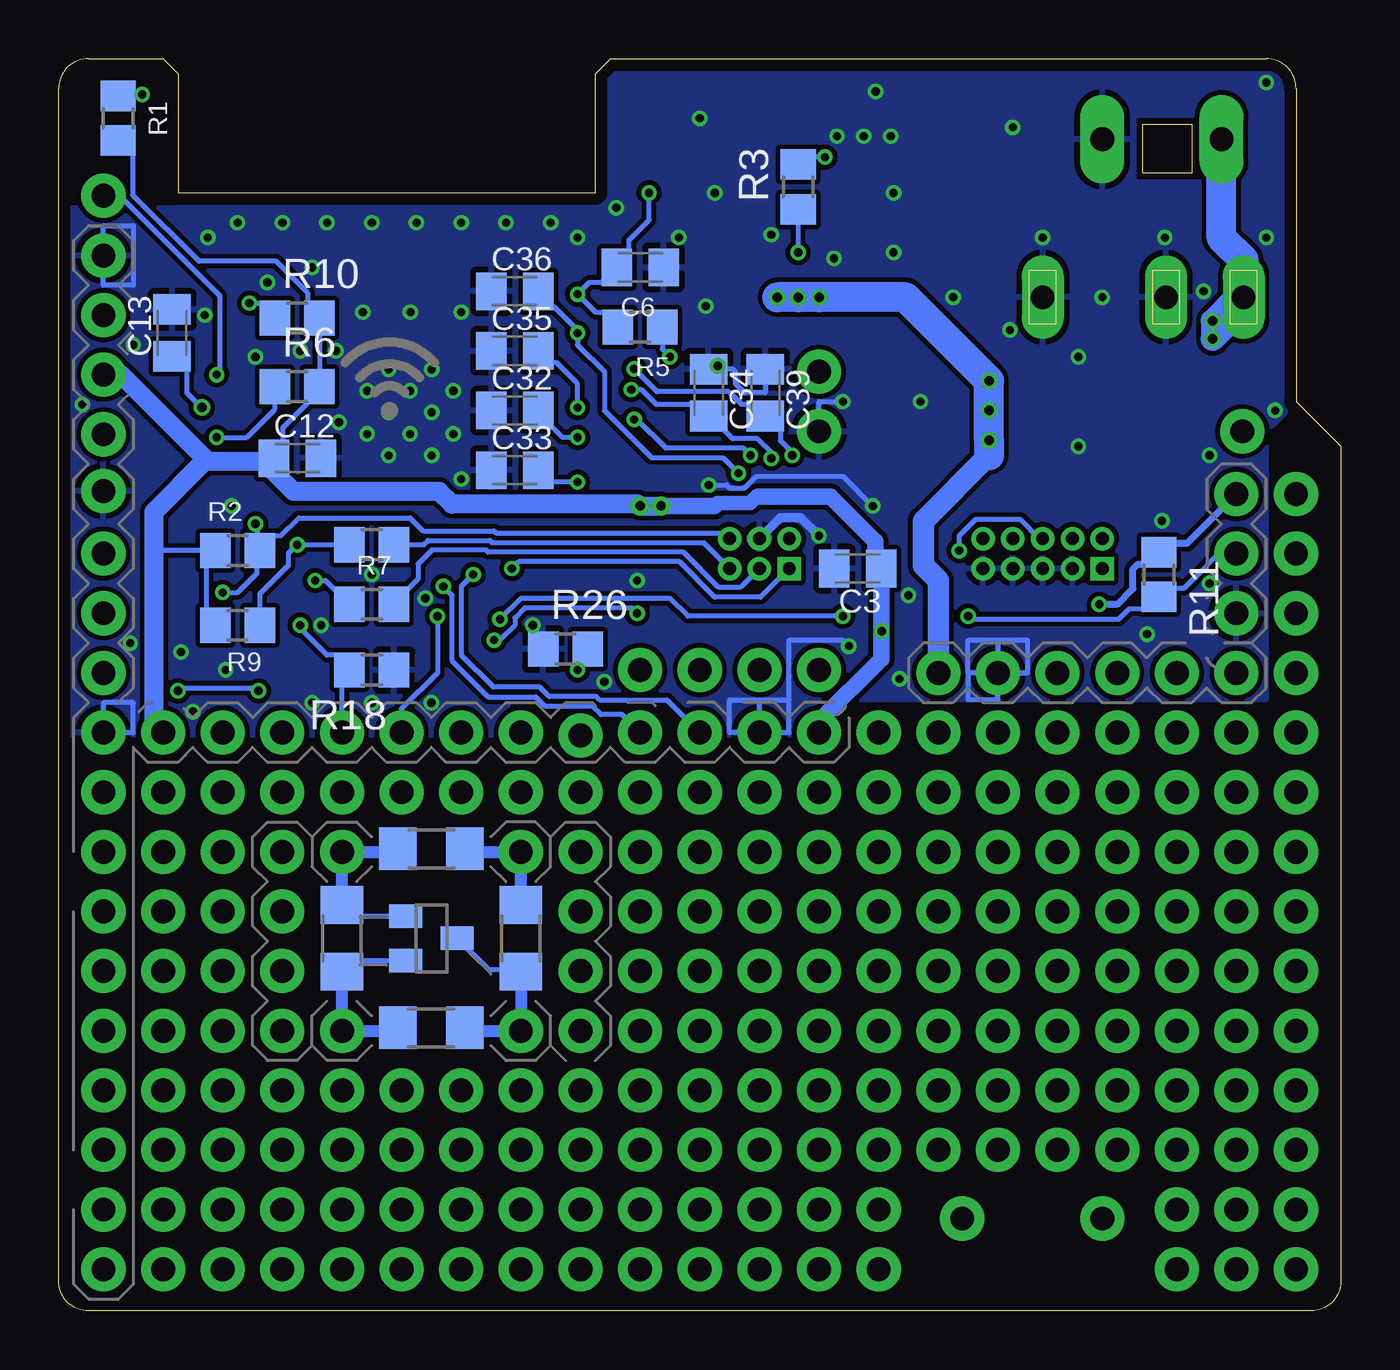
[diagram p2: board, bottom side, seen from below]

Size 54.61 x 53.34 mm. Coordinates in mm from the lower left corner, seen from the top.
Outline: 1.27,0 53.34,0 arc90 54.61,1.27 54.61,52.07 arc90 53.34,53.34 50.16,53.34 49.53,52.7 49.53,47.62 31.75,47.62 31.75,52.7 31.11,53.34 3.17,53.34 arc90 1.91,52.07 1.91,38.73 0,36.83 0,1.27 arc90 1.27,0
Copper layers (1*16): Top 0.035mm / dielectric 1.6mm / Bottom 0.035mm
Design rules "Elecrow_2-layer_PCB_eagle_rule": minimum track width 6mil, minimum drill 12mil, track to track 6mil, track to pad 6mil, pad to pad 6mil, via to via 8mil, smd to smd 0mil, copper to edge 20mil, drill to drill 10mil, minimum pad ring 6mil, minimum via ring 6mil, stop-mask expansion 0mil, vias tented up to drill 100mil, thermal gap 10mil

### Footprints (pad centres in the part's own frame; a part is rotated, then mirrored left to right if it is on the bottom)
C1206K = smd 1.5 x 2: 1 -1.5,0; 2 1.5,0
C0805K = smd 1.3 x 1.6: 1 -1,0; 2 1,0
CHIPLED_0805 = smd 1.2 x 1.2: A 0,-1.05; C 0,1.05
1X09_NO_SILK = drill 1.016 pad 1.88: 1 0,0; 2 2.54,0; 3 5.08,0; 4 7.62,0; 5 10.16,0; 6 12.7,0; 7 15.24,0; 8 17.78,0; 9 20.32,0
1X01NS_KIT = drill 1.016 pad 1.88: 1 0,0
1X04_NO_SILK = drill 1.016 pad 1.88: 1 0,0; 2 2.54,0; 3 5.08,0; 4 7.62,0
SO08 = smd 0.6 x 2.2: 1 -1.905,-2.6; 2 -0.635,-2.6; 3 0.635,-2.6; 4 1.905,-2.6; 5 1.905,2.6; 6 0.635,2.6; 7 -0.635,2.6; 8 -1.905,2.6
SOIC127P600X175-8N = smd 1.525 x 0.7: 1 -2.712,1.905; 2 -2.712,0.635; 3 -2.712,-0.635; 4 -2.712,-1.905; 5 2.712,-1.905; 6 2.712,-0.635; 7 2.712,0.635; 8 2.712,1.905
1X01_NO_SILK = drill 1.016 pad 1.88: 1 0,0
1X03_NO_SILK = drill 1.016 pad 1.88: 1 0,0; 2 2.54,0; 3 5.08,0
1X01_NO_SILK_LONGPAD = drill 1.016 pad 1.88 long: 1 0,0
1X05_NO_SILK = drill 1.016 pad 1.88: 1 0,0; 2 2.54,0; 3 5.08,0; 4 7.62,0; 5 10.16,0
1X08_NO_SILK = drill 1.016 pad 1.88: 1 0,0; 2 2.54,0; 3 5.08,0; 4 7.62,0; 5 10.16,0; 6 12.7,0; 7 15.24,0; 8 17.78,0
DC044025A20 = drill 1 pad 1.778 long: 1 0,-8.56; 2 0,0; 3 0,-5.258
1X12_NO_SILK = drill 1.016 pad 1.88: 1 0,0; 2 2.54,0; 3 5.08,0; 4 7.62,0; 5 10.16,0; 6 12.7,0; 7 15.24,0; 8 17.78,0; 9 20.32,0; 10 22.86,0; 11 25.4,0; 12 27.94,0
1X02_NO_SILK = drill 1.016 pad 1.88: 1 0,0; 2 2.54,0
DC3-10-1P27 = drill 0.55 pad 1 square: 1 0,0 | drill 0.55 pad 1: 2 0,1.27; 3 1.27,0; 4 1.27,1.27; 5 2.54,0; 6 2.54,1.27; 7 3.81,0; 8 3.81,1.27; 9 5.08,0; 10 5.08,1.27
INDPM4040X130N = smd 2.15 x 3.5: 1 -1.6,0; 2 1.6,0
DC3-06-1P27 = drill 0.55 pad 1 square: 1 0,0 | drill 0.55 pad 1: 2 0,1.27; 3 1.27,0; 4 1.27,1.27; 5 2.54,0; 6 2.54,1.27
SOT23 = smd 1 x 1.4: 1 -0.95,-1.1; 2 0.95,-1.1; 3 0,1.1
R0805 = smd 1.3 x 1.5: 1 -0.95,0; 2 0.95,0
TACTILE_SWITCH_SMD_4X3MM = smd 1.27 x 1.524: 1 -2.032,0; 2 2.032,0
R1206 = smd 1.6 x 1.803: 1 -1.422,0; 2 1.422,0
SOT23-5 = smd 0.55 x 1.2: 1 -0.95,-1.3; 2 0,-1.3; 3 0.95,-1.3; 4 0.95,1.3; 5 -0.95,1.3
ESP-WROOM-32D = smd 1.5 x 1: 1 -9.25,7; 2 -9.25,5.73; 3 -9.25,4.46; 4 -9.25,3.19; 5 -9.25,1.92; 6 -9.25,0.65; 7 -9.25,-0.62; 8 -9.25,-1.89; 9 -9.25,-3.16; 10 -9.25,-4.43; 11 -9.25,-5.7; 12 -9.25,-6.97; 13 -9.25,-8.24; 14 -9.25,-9.51; 25 9.25,-9.51; 26 9.25,-8.24; 27 9.25,-6.97; 28 9.25,-5.7; 29 9.25,-4.43; 30 9.25,-3.16; 31 9.25,-1.89; 32 9.25,-0.62; 33 9.25,0.65; 34 9.25,1.92; 35 9.25,3.19; 36 9.25,4.46; 37 9.25,5.73; 38 9.25,7 | smd 1 x 1.5: 15 -5.7,-11.25; 16 -4.43,-11.25; 17 -3.16,-11.25; 18 -1.89,-11.25; 19 -0.62,-11.25; 20 0.65,-11.25; 21 1.92,-11.25; 22 3.19,-11.25; 23 4.46,-11.25; 24 5.73,-11.25 | smd 5.08 x 5.08: GND -1,-0.462 | drill 0.35 pad 0.61: GND_1 -1.917,1.373; GND_2 -0.083,1.373; GND_3 -2.835,0.456; GND_4 -1,0.456; GND_5 0.835,0.456; GND_6 -1.917,-0.462; GND_7 -0.083,-0.462; GND_8 -2.835,-1.379; GND_9 -1,-1.379; GND_10 0.835,-1.379; GND_11 -1.917,-2.297; GND_12 -0.083,-2.297
TEXAS_INSTRUMENTS_TPS562201DDCT_0 = smd 1.1 x 0.6: 1 -1.35,0.95; 2 -1.35,0; 3 -1.35,-0.95; 4 1.35,-0.95; 5 1.35,0; 6 1.35,0.95

### Placement (x,y rotation side)
C1  16.51,43.43 0 top
C2  21.72,43.43 0 top
C3  20.57,31.62 180 bottom
C4  27.94,35.94 180 top
C5  29.21,45.09 90 top
C6  29.84,44.45 180 bottom
C7  16.89,51.94 0 top
C8  4.32,40.01 180 top
C9  21.21,46.23 180 top
C10  26.04,41.66 0 top
C11  26.67,45.09 90 top
C12  44.45,36.32 0 bottom
C13  49.78,41.66 90 bottom
C32  35.18,38.35 0 bottom
C33  35.18,35.81 0 bottom
C34  26.92,39.12 270 bottom
C35  35.18,40.89 0 bottom
C36  35.18,43.43 0 bottom
C39  24.51,39.12 270 bottom
D1  17.91,39.75 90 top
D2  52.07,50.8 180 top
GND_SIDE  52.7,22.1 270 top
HI-LINK_AC1  10.16,3.94 180 bottom
HI-LINK_AC2  16.13,3.94 180 bottom
HI-LINK_VOUT+  4.19,37.47 0 bottom
I2C  22.23,24.64 0 top
IC  38.73,15.75 90 top
IC2  10.16,38.73 180 top
IO0  52.7,47.5 0 top
IO0_GND  52.7,44.96 270 top
J1  1.91,4.32 0 top
J2  12.06,24.64 0 top
J3  10.16,49.91 90 top
J4  5.08,49.91 90 top
J5  4.45,32.26 0 top
J6  1.91,27.18 90 top
J7  4.45,29.72 0 top
J8  19.68,1.78 0 top
J9  32.38,22.1 0 top
J10  12.7,43.18 270 top
J11  52.7,37.34 0 top
J12  42.55,24.64 0 top
J13  32.38,9.4 0 top
J14  32.38,6.86 0 top
J15  32.38,4.32 0 top
J16  32.38,1.78 0 top
J17  1.91,9.4 0 top
J18  45.09,11.94 90 top
J19  32.38,19.56 270 top
J20  47.62,11.94 90 top
J21  19.68,4.32 0 top
J22  1.91,11.94 0 top
J23  1.91,22.1 0 top
J24  50.16,11.94 90 top
J25  1.91,19.56 0 top
J26  1.91,6.86 0 top
J27  1.91,17.02 0 top
J28  1.91,14.48 0 top
J29  4.45,34.8 0 top
J30  34.92,24.64 0 top
J31  52.7,24.64 0 top
J32  34.92,11.94 0 top
J33  42.55,11.94 0 top
J34  34.92,19.56 0 top
J35  42.55,19.56 0 top
J36  32.38,24.51 0 top
J37  52.7,34.92 0 top
J38  40.01,24.64 90 top
J40  50.16,24.64 0 top
J41  37.47,24.64 90 top
J42  52.7,39.88 180 top
J43  29.84,27.3 180 top
J45  1.91,1.78 0 top
J46  52.7,32.26 0 top
J47  45.09,24.64 0 top
J48  47.62,24.64 0 top
J49  52.7,29.72 0 top
J50  52.7,27.18 0 top
J51  9.53,27.18 0 top
J52  6.99,27.18 0 top
J53  4.45,27.18 0 top
J54  12.06,27.18 0 top
J55  52.7,42.42 0 top
J57  1.91,24.64 0 top
J_12V1  14.61,27.18 0 top
J_VIN_5V  22.23,37.47 90 top
JTAG  10.16,31.62 0 top
L1  16.64,47.88 270 top
PROG  23.5,31.62 0 top
Q1  38.73,15.88 270 bottom
R1  52.07,50.8 90 bottom
R2  46.99,32.38 0 bottom
R3  23.11,47.88 90 bottom
R4  17.91,37.47 0 top
R5  29.84,41.91 180 bottom
R6  44.45,39.37 0 bottom
R7  41.27,30.1 180 bottom
R8  41.27,32.64 180 bottom
R9  46.99,29.21 0 bottom
R10  44.45,42.29 0 bottom
R11  7.75,31.37 270 bottom
R12  25.27,49.15 270 top
R13  21.97,51.94 0 top
R18  41.27,27.3 180 bottom
R26  33.02,28.19 0 bottom
RESET  28.19,50.04 270 top
SMD1  38.73,12.06 0 bottom
SMD2  38.73,19.68 180 bottom
SMD7  34.92,15.88 90 bottom
SMD8  42.55,15.88 90 bottom
U1  26.54,38.73 270 top
U2  40.64,38.73 0 top
U3  21.59,49.15 0 top

### Tracks (layer width: path | path; a pad name or v marks a point on that pad's centre or on a via)
+3V3  (via drill 0.35, 0.4 pad 0.8)
  Top 0.203: v28.57,40.64 29.07,40.64
  Top 0.305: v10.29,30.1 10.54,29.84 14.61,29.84 15.54,28.91 19.51,28.91 v19.56,28.96
  Top 0.61: U1.5 28.75,39.69 29.07,39.37
  Top 0.813: U2.2 30.1,44.47 29.72,44.09 C5.1 | 29.07,35.81 29.07,34.4 v28.96,34.29 v29.84,34.29 | 29.07,35.81 C4.1 | C5.1 C11.1 27.16,44.09 28,43.24 | 28,43.24 29.07,42.18 29.07,40.64 29.07,39.37 29.07,35.81 | 28,43.24 28.84,44.09 C5.1
  Bottom 0.203: R5.1 28.89,40.96 v28.57,40.64 | R9.1 48.32,29.59 48.32,32 R2.1 50.55,32.38 | R1.1 52.02,49.85 51.46,49.28 51.46,47.53 48.63,44.71 45.34,44.71 44.01,43.37 44.01,42.8 R10.2 R6.2 44.01,38.86 44.01,38.67 45.07,37.61 45.07,36.7 C12.1
  Bottom 0.305: 19.57,29.21 19.56,29.19 v19.56,28.96 | J29.1 6.54,32.7 7.37,32.7 R11.1 8.26,31.81 8.64,31.81 8.85,31.6 8.85,30.77 9.53,30.1 v10.29,30.1
  Bottom 0.61: 24.82,34.69 24.89,34.69 25.16,34.42 26.54,34.42 26.67,34.29
  Bottom 0.711: I2C.1 22.23,25.12 19.57,27.77 19.57,29.21 C3.1 19.83,31.88 19.83,32.78 21.74,34.69 24.82,34.69 | v28.96,34.29 v28.95,34.29 26.67,34.29
  Bottom 0.813: v28.96,34.29 v29.84,34.29 29.92,34.37 37.85,34.37 38.4,34.91 44.61,34.91 45.45,35.75 C12.1 45.58,36.2 48.26,36.2 | J42.1 51.94,39.88 48.26,36.2 | J40.1 50.55,25.02 50.55,32.38 50.55,34.04 48.39,36.2 48.26,36.2
+5V
  Top 0.203: U1.3 25.3,37.85 25.66,37.85 26.16,38.34 26.16,39.12 25.66,39.62 25.3,39.62 U1.1 | C10.1 24.91,41.78 24.91,47.83 R12.2
  Top 0.406: L1.2 15.49,46.28 15.43,46.34
  Top 0.508: U1.1 25.04,39.89
  Top 0.61: 25.04,39.89 C10.1
  Top 1.016: 15.43,46.34 15.26,46.18 15.26,43.69 C1.1 15.01,42.83 16.18,41.66 22.23,41.66 | C10.1 22.23,41.66 | 22.23,41.66 J_VIN_5V.2
+12V  (via drill 0.35, 0.4)
  Top 0.203: v14.99,37.08 15.37,37.47 R4.1 | v23.11,45.09 23.11,45.12 23.22,45.22 | C2.2 23.22,43.28 v23.11,43.18
  Top 0.61: U3.3 20.76,48.2 22.21,46.75 C9.1
  Top 0.711: IC2.2 IC2.1 13,36.96 14.86,36.96 v14.99,37.08
  Top 0.914: IC2.2 IC2.3 14.73,39.37 v14.99,39.62 | v22.23,43.18 v23.11,43.18 v24,43.18
  Top 1.27: C2.2 23.22,45.22 C9.1
  Bottom 0.203: R3.1 v23.11,45.09
  Bottom 0.914: J_12V1.2 17.14,31.11 17.78,31.75 17.78,33.66 14.99,36.45
  Bottom 1.27: v24,43.18 v23.11,43.18 v22.23,43.18 18.54,43.18 v14.99,39.62 v14.99,37.08 14.99,36.45
  other vias: 14.99,38.35
  pour Top (no thermals): 12.19,40.01 12.19,36.58 15.37,36.58 15.37,40.01
D2A  (via drill 0.35)
  Top 0.152: v51.05,51.82 52.04,51.82 D2.A
  Bottom 0.152: R1.2 51.12,51.75 v51.05,51.82
EN  (via drill 0.35)
  Top 0.203: v29.46,47.62 28.57,47.62 RESET.2 | U2.3 32.51,43.2 v32.51,43.31 33.15,42.67 33.15,41.22 35.05,39.31 35.05,31.88 v35.31,31.62
  Bottom 0.203: v29.46,47.62 29.46,46.47 30.34,45.59 30.34,44.96 C6.2 31.48,43.81 32,43.81 v32.51,43.31 31.75,42.55 30.92,42.55 30.8,42.42 R5.2 | PROG.1 24.71,30.41 26.67,30.41 28.17,31.91 35.02,31.91 v35.3,31.62 v35.31,31.62
GND  (via drill 0.35)
  Top 0.203: IO0_GND.1 52.7,43.69 53.98,43.69 53.98,44.96 IO0_GND.1 | IO0_GND.1 52.7,46.23 51.44,46.23 51.44,44.96 IO0_GND.1 | J_12V1.1 14.61,26.04 | 14.61,26.04 15.88,26.04 15.88,27.18 J_12V1.1 | J_12V1.1 13.34,27.18 13.34,26.04 14.61,26.04 | I2C.2 23.5,24.64 23.5,26.04 24.77,26.04 | 24.77,26.04 26.04,26.04 26.04,24.64 I2C.2 | 24.77,26.04 I2C.2 | J_VIN_5V.1 22.23,38.73 U1.2 | v48.9,25.53 48.87,25.5 48.87,24.12 48.14,23.39 44.57,23.39 43.84,24.12 43.84,25.15 44.57,25.88 45.6,25.88 45.7,25.78 46.36,25.78 47.73,27.14 | v49.4,28.07 51.83,28.07 52.19,28.42 53.22,28.42 53.95,27.69 53.95,26.66 50.68,23.39 49.65,23.39 48.92,24.12 48.92,26.01 | J31.1 51.44,24.64 51.44,25.91 52.7,25.91 J31.1
  Top 0.305: v10.16,43.18 10.16,41.66 7.37,41.66 7.37,43.1 J10.3
  Top 0.61: J10.2 12.7,40.81 IC2.4
  Top 0.813: J31.1 GND_SIDE.1 GND_SIDE.2 GND_SIDE.3 GND_SIDE.4 GND_SIDE.5 GND_SIDE.6 GND_SIDE.7 GND_SIDE.8 GND_SIDE.9
  Bottom 0.203: J_VIN_5V.1 22.23,38.73 v21.21,38.73 | v20.95,28.32 21.21,28.57 23.5,28.57 23.5,26.04 | I2C.2 23.5,24.64 23.5,26.04 | I2C.2 24.77,26.04 | 24.77,26.04 23.5,26.04 | I2C.2 26.04,24.64 26.04,26.04 24.77,26.04 | J_12V1.1 15.88,27.18 | 14.61,28.57 15.88,28.57 15.88,27.18 | 15.88,27.18 15.88,26.04 14.61,26.04 J_12V1.1 | 14.61,28.57 J_12V1.1 | v26.92,35.18 26.16,35.18 26.04,35.05 25.39,35.05 24.88,35.56 21.21,35.56 v19.94,34.29 | 14.61,28.57 13.34,28.57 13.34,27.18 J_12V1.1 | C39.1 24.51,39.12 25.4,39.12 25.78,39.5 25.78,40.01 25.89,40.12 C34.1 | J31.1 51.44,24.64 51.44,25.91 52.7,25.91 J31.1 | IO0_GND.1 52.7,46.23 51.44,46.23 51.44,43.69 52.7,43.69 IO0_GND.1
  Bottom 0.406: PROG.4 24.4,33.26 24.4,33.27 23.87,33.8 23.01,33.8 v22.23,33.02
  other vias: 48.26,45.72 28.19,45.72 30.86,46.99 32.51,45.72 26.54,40.26 16.51,43.18 29.97,31.11 37.47,35.43 43.81,25.91 31.37,26.8 34.42,29.21 38.99,30.35 43.43,29.21 47.5,27.3 41.27,31.37 37.47,42.55 51.56,28.45 53.59,38.61 51.44,41.15 8.26,28.83 18.41,30.48 48.39,42.42 5.59,36.45 7.62,33.66 7.49,45.72 13.97,50.42 12.7,45.72 5.84,43.43 19.81,51.94 19.18,50.04 21.46,50.04 19.05,47.62 19.05,45.09 21.59,44.83 11.18,40.64 27.05,42.8 24.26,45.85 26.67,47.62 20.32,50.04 27.3,50.8 14.1,41.78 5.59,30.99 11.18,36.83 18.8,26.92 41.27,25.91 46.23,40.64 44.32,40.89 42.8,40.89 45.72,43.81 47.24,34.29 38.73,25.91 42.67,37.85 17.91,38.73 2.79,38.35 3.17,45.72 3.17,52.32 43.81,44.45 37.47,46.35 39.37,46.35 41.27,46.35 43.18,46.35 33.66,46.35 35.56,46.35 45.09,46.35 46.99,46.35 39.62,42.55 41.66,42.55
  pour Top (rank 6): 3.17,53.34 1.91,52.07 1.91,38.73 3.17,37.47 3.17,26.04 22.23,26.04 22.23,24.51 54.61,24.51 54.61,46.99 49.53,46.99 43.18,53.34
  pour Bottom (rank 6): 3.17,53.34 1.91,52.07 1.91,38.73 3.17,37.47 3.17,26.04 21.59,26.04 21.59,24.51 54.61,24.51 54.61,46.99 49.53,46.99 43.18,53.34
  pour Top (no thermals): 19.05,50.8 21.21,50.8 21.21,49.4 19.05,49.4
  pour Top (no thermals): 19.3,50.55 21.21,50.55 21.21,49.66 19.3,49.66
IO0  (via drill 0.35)
  Top 0.203: U2.25 48.88,29.23 47.62,30.48 v47.62,30.61 | v46.23,33.53 46.23,34.22 46.76,34.76 46.76,38.77 v47.87,39.88 v47.88,39.88 | IO0.1 52.42,47.5 52.07,47.84 D2.C
  Bottom 0.203: 46.17,32.51 46.17,33.47 v46.23,33.53 | 46.17,32.51 R2.2 45.41,33.02 45.15,33.02 44.39,33.78 39.63,33.78 39.08,33.23 36.08,33.23 35.99,33.14 26.28,33.14 PROG.6 | v47.62,30.61 46.99,30.61 46.17,31.43 46.17,32.51 | IO0.1 52,47.5 47.75,43.25 47.75,40 v47.88,39.88
IO2  (via drill 0.35)
  Top 0.203: J50.1 52.45,27.18 51.82,26.54 49.66,26.54 v49.53,26.42 | v46.1,26.42 46.1,27.22 U2.24
  Bottom 0.203: v49.53,26.42 49.4,26.54 46.23,26.54 v46.1,26.42
IO4
  Top 0.203: U2.26 51.93,30.5 J49.1
IO5
  Top 0.203: J46.1 52.7,32.38 50.78,34.3 U2.29
IO12
  Top 0.203: JTAG.8 14.1,32.89 14.91,33.7 15.88,33.7 16.65,32.92 18.88,32.92 22.52,29.28 29.51,29.28 29.71,29.08 31.25,29.08 U2.14
IO13  (via drill 0.35)
  Top 0.203: U2.16 36.07,27.63 v36.07,28.57 | JTAG.4 11.56,32.89 12.37,33.7 14.2,33.7 14.33,33.7 14.74,34.11 15.24,34.11 16.06,34.11 16.84,33.33 19.05,33.33 22.69,29.69 29.95,29.69 v29.97,29.72
  Bottom 0.203: v36.07,28.57 35.81,28.57 35.18,29.2 35.18,29.52 34.76,29.94 30.2,29.94 v29.97,29.72
IO14
  Top 0.203: JTAG.2 10.29,32.89 11.1,33.7 11.79,33.7 12.2,34.11 14.16,34.11 14.57,34.52 16.23,34.52 17.01,33.74 19.22,33.74 22.86,30.1 29.2,30.1 29.45,30.35 31.25,30.35 U2.13
IO15  (via drill 0.35)
  Top 0.203: v35.81,29.46 36.2,29.46 37.12,28.54 40.65,28.54 40.66,28.53 40.66,28.54 44.46,28.54 45.02,27.98 45.02,27.57 U2.23 | v21.21,29.59 21.21,30.02 18.71,32.51 16.38,32.51 v16.26,32.38
  Bottom 0.203: v21.21,29.59 27.81,29.59 28.57,30.35 34.93,30.35 v35.81,29.46 | JTAG.6 12.83,32.89 13.64,33.7 15.57,33.7 16.26,33.02 v16.26,32.38
IO16
  Top 0.203: J48.1 47.62,25.89 48.54,26.8 48.54,28.55 46.99,30.1 46.99,30.87 47.36,31.24 47.88,31.24 48.22,31.58 49.7,31.58 U2.27
IO17
  Top 0.203: U2.28 49.81,32.95 49.01,32.95 47.71,31.65 47.19,31.65 46.58,31.04 46.58,29.92 48.13,28.37 48.13,26.97 46.05,24.89 45.09,24.89 J47.1
IO18  (via drill 0.35)
  Top 0.203: U2.30 49.7,35.39 48.91,35.39 48.67,35.15 48.67,33.23 47.49,32.06 46.99,32.06 44.32,29.39 v44.32,29.21
  Bottom 0.203: v44.32,29.21 44.32,29.08 43.18,27.94 42.73,27.94 42.23,27.43 R18.2 42.55,26.98 J12.1
IO19  (via drill 0.4)
  Top 0.203: J11.1 52.59,37.23 50.27,37.23 U2.31 49.55,37.18 48.8,37.18 48.51,37.47 v48.51,38.48
  Bottom 0.203: C13.1 49.53,40.66 49.15,40.27 49.15,39.12 v48.51,38.48
IO21  (via drill 0.35)
  Top 0.203: U2.33 48.4,39.38 47.75,38.73 47.75,37.34 v47.88,37.21 47.88,33.02 47.37,32.51 46.86,32.51 44.2,29.84 40.52,29.84 39.38,30.99 38.35,30.99 v38.23,30.86
  Bottom 0.203: I2C.4 30.61,25.4 31.51,25.4 31.87,25.76 33.88,25.76 34.29,26.16 36.32,26.16 37.85,27.69 37.85,30.48 v38.23,30.86 | v47.88,37.21 46.61,37.21 45.4,38.42 R6.1
IO22  (via drill 0.35)
  Top 0.203: v36.96,31.37 37.85,32.26 41.85,32.26 44.96,35.37 44.96,40.39 46.48,41.91 v46.48,42.93 46.75,43.2 U2.36
  Bottom 0.203: I2C.3 28.7,26.04 31.57,26.04 31.7,26.17 33.72,26.17 34.12,26.57 36.09,26.57 37.44,27.91 37.44,30.89 v36.96,31.37 | R10.1 46.03,42.93 v46.48,42.93
IO23
  Top 0.203: U2.37 50.23,44.13 50.89,44.13 52.6,42.42 J55.1
IO25
  Top 0.203: U2.10 31.47,34.22 32.39,34.22 32.55,34.07 32.55,32.87 33.26,32.15 33.26,26.04 34.56,24.74 34.92,24.74 J30.1
IO26  (via drill 0.35)
  Top 0.203: U2.11 31.73,32.7 32.14,32.7 32.85,31.98 32.85,27.3 | J36.1 32.85,24.98 32.85,27.3 | 32.85,27.3 v32.51,27.3
  Bottom 0.203: R26.2 32.51,27.75 v32.51,27.3
IO27  (via drill 0.35)
  Top 0.203: U2.12 31.47,31.68 32.27,31.68 32.45,31.5 32.45,28.6 32.27,28.42 30.51,28.42 30.26,28.68 29.54,28.68 29.34,28.87 22.35,28.87 22.27,28.96 20.95,28.96 20.31,29.59 v15.88,29.59
  Bottom 0.203: J5.1 5.21,32.26 6.22,31.25 6.22,31.24 6.67,30.8 7.37,30.8 R11.2 8.26,29.91 9.02,29.91 9.46,29.46 15.75,29.46 v15.88,29.59
IO32  (via drill 0.35)
  Top 0.203: U2.8 31.51,36.84 31.88,37.21 v32.51,37.21 33.36,36.36 33.36,33.31 34.08,32.6 34.08,31.33 34.9,30.51 36.3,30.51 36.51,30.29 36.77,30.29 37.47,29.59 v38.48,29.59
  Bottom 0.203: v38.48,29.59 38.48,27.18 40.01,25.65 J38.1 | C32.2 34.18,38.24 33.15,37.21 v32.51,37.21
IO33  (via drill 0.35)
  Top 0.203: J41.1 36.83,24.64 35.56,25.91 34.43,25.91 33.67,26.67 33.67,32.37 32.95,33.09 32.95,34.86 v32.51,35.31 32.5,35.32 31.64,35.32 U2.9
  Bottom 0.203: v32.51,35.31 33.91,35.31 34.18,35.58 C33.2
IO34  (via drill 0.35)
  Top 0.203: U2.6 31.25,39.24 v30.23,39.24 | v24.26,36.32 24.26,36.2 23.85,35.79 14.11,35.79 13.75,35.43 8.07,35.43 6.8,34.17 6.8,27.36 J52.1
  Bottom 0.203: v24.26,36.32 24.26,36.58 24.84,37.16 25.91,37.16 26.29,37.54 26.29,37.61 26.8,38.12 C34.2 27.43,38.62 29.17,38.62 29.79,39.24 v30.23,39.24
IO35  (via drill 0.35)
  Top 0.203: v30.1,37.97 31.25,37.97 U2.7 31.51,38.12 31.88,38.48 v32.51,38.48 | v25.15,36.45 25.15,36.2 24.33,35.38 14.28,35.38 13.82,34.92 9.54,34.92 8.48,33.87 8.48,30.31 9.53,29.27 J51.1
  Bottom 0.203: v30.1,37.97 29.97,37.97 28.75,36.75 25.45,36.75 v25.15,36.45 | C35.2 34.18,40.39 33.4,40.39 32.51,39.5 v32.51,38.48
IO36  (via drill 0.35)
  Top 0.203: v32.51,41.66 32.24,41.92 U2.4 | v25.65,35.69 25.47,35.69 24.75,34.97 14.45,34.97 13.99,34.52 9.71,34.52 8.89,33.7 8.89,30.48 12.06,27.3 J54.1
  Bottom 0.203: v25.65,35.69 26.31,36.34 29.36,36.34 31.37,38.34 31.37,40 32.51,41.15 v32.51,41.66 32.51,41.77 33.54,42.8 33.92,42.8 34.18,43.05 C36.2
IO39  (via drill 0.35)
  Top 0.203: U2.5 30.37,40.66 30.1,40.39 v30.1,40.13 | v23.37,36.45 23.11,36.2 13.94,36.2 13.58,35.84 7.65,35.84 6.35,34.54 6.35,29.08 J53.1
  Bottom 0.203: v30.1,40.13 29.13,39.16 26.06,39.16 25.53,38.62 25.02,38.62 C39.2 23.88,37.48 23.88,37.08 23.37,36.58 v23.37,36.45
N$3
  Top 0.508: IC.7 33.02,15.11 J19.3
N$4
  Top 0.508: IC.6 33.02,16.38 J19.2
N$5
  Top 0.508: IC.1 43.18,13.84 J18.1
N$6
  Top 0.508: IC.2 44.45,15.11 J18.2
N$7
  Top 0.508: IC.3 44.45,16.38 J18.3
N$8
  Top 0.508: IC.4 43.18,17.65 J18.4
N$9
  Top 0.508: J19.1 34.29,17.65 IC.5
N$10
  Top 0.508: IC.8 34.29,13.84 J19.4
N$15
  Bottom 0.508: SMD2.1 37.19,19.56 J34.1 SMD7.2
N$16
  Bottom 0.203: SMD8.2 42.07,16.82 Q1.1
  Bottom 0.508: SMD2.2 40.28,19.56 J35.1 SMD8.2
N$18
  Bottom 0.203: Q1.3 36.28,14.52 34.99,14.52 SMD7.1
  Bottom 0.508: SMD1.2 37.19,11.94 J32.1 SMD7.1
N$19
  Bottom 0.203: SMD8.1 42.07,14.93 Q1.2
  Bottom 0.508: SMD1.1 40.28,11.94 J33.1 SMD8.1
PROG_RXD
  Bottom 0.203: PROG.5 27.14,32.73 36.16,32.73 36.24,32.82 38.88,32.82 39.06,32.64 R8.1
PROG_TXD
  Bottom 0.203: PROG.3 25.57,30.82 26.5,30.82 28,32.32 36.32,32.32 36.41,32.41 38.71,32.41 39.3,31.82 39.3,31.18 40.33,30.16 R7.1
PWR_LED
  Top 0.203: R4.2 18.86,39.65 D1.A
RXD0  (via drill 0.35)
  Top 0.203: v44.45,32.64 44.45,33.02 46.35,34.92 46.35,39.25 47.76,40.66 U2.34
  Bottom 0.203: R8.2 v44.45,32.64 44.83,32.26 44.83,31.75 46.04,30.54 R9.2
SW
  Top 0.254: C7.1 15.89,50.23 L1.1
  Top 0.61: U3.2 16.97,49.15 L1.1
  pour Top (rank 2, no thermals): 17.53,50.16 18.03,50.16 18.8,49.4 20.7,49.4 20.7,48.9 19.68,48.9 19.3,48.51 17.53,48.51
TXD0  (via drill 0.35)
  Top 0.203: v43.69,31.11 43.69,32.89 45.95,35.15 45.95,39.42 47.8,41.27 48.32,41.27 48.97,41.92 U2.35
  Bottom 0.203: v43.69,31.11 43.24,31.11 R7.2
VBST
  Top 0.254: C7.2 18.8,51.94 19.91,50.82 22.72,50.82 22.94,50.61 U3.6
VCC  (via drill 0.4)
  Top 0.61: IC2.7 IC2.8 | C8.1 6.81,40.01 IC2.6
  Top 1.016: IC2.7 IC2.6 | v5.46,41.4 4.14,42.72 J10.1 4.45,43.18 v5.46,42.16 v5.46,41.4 | v5.46,41.4 5.46,40.15 C8.1
  Top 1.27: C8.1 6.69,40.01
  Bottom 1.016: v5.46,42.16 4.45,43.18 J10.1 4.14,42.72 v5.46,41.4 v5.46,42.16
  Bottom 1.27: J10.1 4.14,44.78 5.08,45.72 J4.1
  pour Top (no thermals): 5.97,37.34 6.86,36.45 9.91,36.45 9.91,41.02 5.97,41.02
VEN  (via drill 0.35)
  Top 0.203: U3.5 v21.97,49.15
  Bottom 0.203: v21.97,49.15 22.79,49.15 R3.2
VFB
  Top 0.203: U3.4 23,48.26 23.75,48.26 24,48.51 24,49.72 24.38,50.1 R12.1 24.77,50.61 24.77,50.99 23.81,51.94 R13.2

### Text on the board
tNames: TODO HLK covers PROG / TODO this
tValues: 4.7uH | 3.3V
tDocu: VIN | GND | STATE | 7-17V | EN | 0 | VIN | GND | GND | GND | 23 | PWR | 5V | 3V3 | SI4431 / BDY | GND | 19 | 3V3 | JTAG | PROG | GND | 14 | 13 | 15 | 12 | NC | NC | GND | IO0 | 27 | 5 | G | EN | TXD | RXD | GND | GND | 4 | 34 | 35 | 36 | GND | VCC | 39 | 2 | 3V3 | G | 22 | 21 | 26 | 25 | 33 | 32 | 18 | 17 | 16 | 3V3 | G | GND | GND | AC
bDocu: Mikee © 2021/06 v3.1 | VIN | GND | 0 | GND | 23 | VIN | GND | GND | 5V | 3V3 | GND | 19 | 3V3 | GND | 14 | 13 | 15 | 12 | NC | NC | GND | IO0 | 27 | 5 | EN | TXD | RXD | GND | GND | GND | 4 | 34 | 35 | 36 | GND | VCC | 39 | 2 | 3V3 | G | 22 | 21 | 26 | 25 | 33 | 32 | 18 | 17 | 16 | 3V3 | G | GND | GND | HLK-5M05